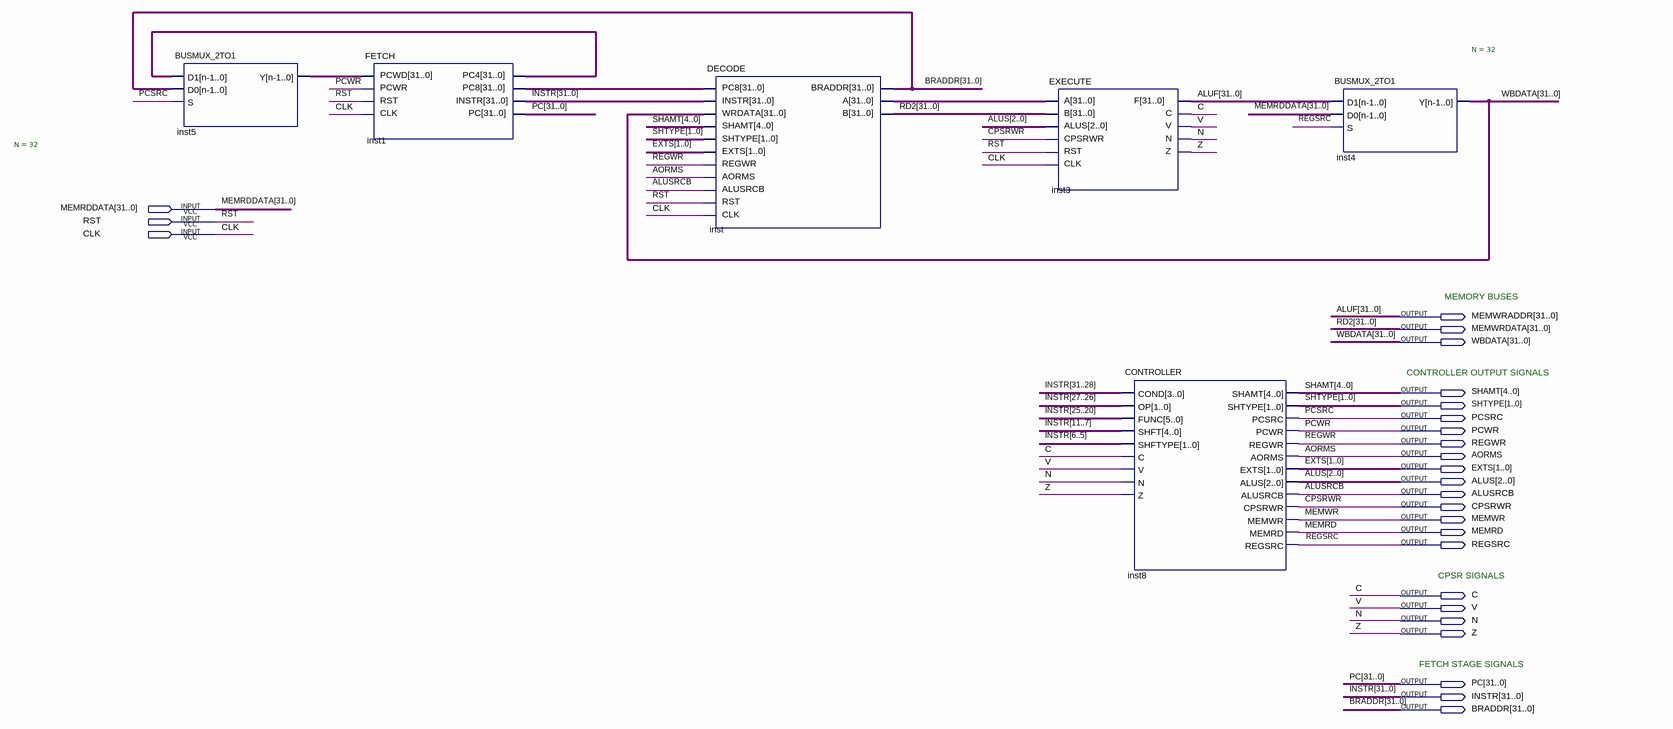
[diagram p0: schematic sheet]
// Quartus schematic SCP.bdf as structural Verilog: 6 symbols, 26 pins
module SCP (
  input  [31:0] MEMRDDATA,
  input  RST,
  input  CLK,
  output [31:0] MEMWRADDR,
  output [31:0] MEMWRDATA,
  output [31:0] WBDATA,
  output [4:0] SHAMT,
  output [1:0] SHTYPE,
  output PCSRC,
  output PCWR,
  output REGWR,
  output AORMS,
  output [1:0] EXTS,
  output [2:0] ALUS,
  output ALUSRCB,
  output CPSRWR,
  output MEMWR,
  output MEMRD,
  output REGSRC,
  output C,
  output V,
  output N,
  output Z,
  output [31:0] PC,
  output [31:0] INSTR,
  output [31:0] BRADDR
);

  wire [31:0] inst1_pc4, inst1_pc8, inst5_y, inst_a;

  BUSMUX_2TO1 #(.N(32)) inst5 (.D1(inst1_pc4), .D0(BRADDR), .S(PCSRC), .Y(inst5_y));
  FETCH inst1 (
    .PCWD(inst5_y), .PCWR(PCWR), .RST(RST), .CLK(CLK), .PC8(inst1_pc8), .PC4(inst1_pc4), .INSTR(INSTR),
    .PC(PC));
  DECODE inst (
    .PC8(inst1_pc8), .INSTR(INSTR), .WRDATA(WBDATA), .SHAMT(SHAMT), .SHTYPE(SHTYPE), .EXTS(EXTS),
    .REGWR(REGWR), .AORMS(AORMS), .ALUSRCB(ALUSRCB), .RST(RST), .CLK(CLK), .BRADDR(BRADDR), .A(inst_a),
    .B(MEMWRDATA));
  EXECUTE inst3 (
    .A(inst_a), .B(MEMWRDATA), .ALUS(ALUS), .CPSRWR(CPSRWR), .RST(RST), .CLK(CLK), .F(MEMWRADDR), .C(C),
    .V(V), .N(N), .Z(Z));
  CONTROLLER inst8 (
    .COND(INSTR[31:28]), .OP(INSTR[27:26]), .FUNC(INSTR[25:20]), .SHFT(INSTR[11:7]), .SHFTYPE(INSTR[6:5]),
    .C(C), .V(V), .N(N), .Z(Z), .SHAMT(SHAMT), .SHTYPE(SHTYPE), .PCSRC(PCSRC), .PCWR(PCWR), .REGWR(REGWR),
    .AORMS(AORMS), .EXTS(EXTS), .ALUS(ALUS), .ALUSRCB(ALUSRCB), .CPSRWR(CPSRWR), .MEMWR(MEMWR),
    .MEMRD(MEMRD), .REGSRC(REGSRC));
  BUSMUX_2TO1 #(.N(32)) inst4 (.D1(MEMWRADDR), .D0(MEMRDDATA), .S(REGSRC), .Y(WBDATA));

  // Other names for the same wires on the sheet: ALUF[31:0] = MEMWRADDR; RD2[31:0] = MEMWRDATA

  // Notes on the sheet:
  //   MEMORY BUSES
  //   CONTROLLER OUTPUT SIGNALS
  //   CPSR SIGNALS
  //   FETCH STAGE SIGNALS
endmodule
